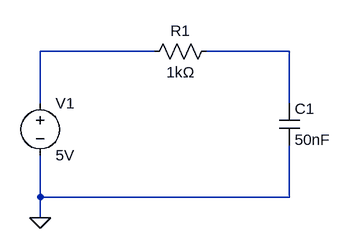
[diagram p0: schematic ex3.asc]
ex3.asc, the LTspice schematic file:
Version 4
SHEET 1 880 680
WIRE 208 -160 32 -160
WIRE 416 -160 288 -160
WIRE 32 -80 32 -160
WIRE 416 -80 416 -160
WIRE 32 64 32 0
WIRE 416 64 416 -16
WIRE 416 64 32 64
WIRE 32 96 32 64
FLAG 32 96 0
SYMBOL voltage 32 -96 R0
WINDOW 123 0 0 Left 0
WINDOW 39 0 0 Left 0
SYMATTR InstName V1
SYMATTR Value 5V
SYMBOL res 304 -176 R90
WINDOW 0 0 56 VBottom 2
WINDOW 3 32 56 VTop 2
SYMATTR InstName R1
SYMATTR Value 1kΩ
SYMBOL cap 400 -80 R0
SYMATTR InstName C1
SYMATTR Value 50nF

The netlist it stands for:
* ex3.asc
V1 N001 0 5V
R1 N002 N001 1kΩ
C1 N002 0 50nF
.backanno
.end